# EAGLE design rng.1.0 (EAGLE 6.3)
Assembly variants: 3cpu, proto
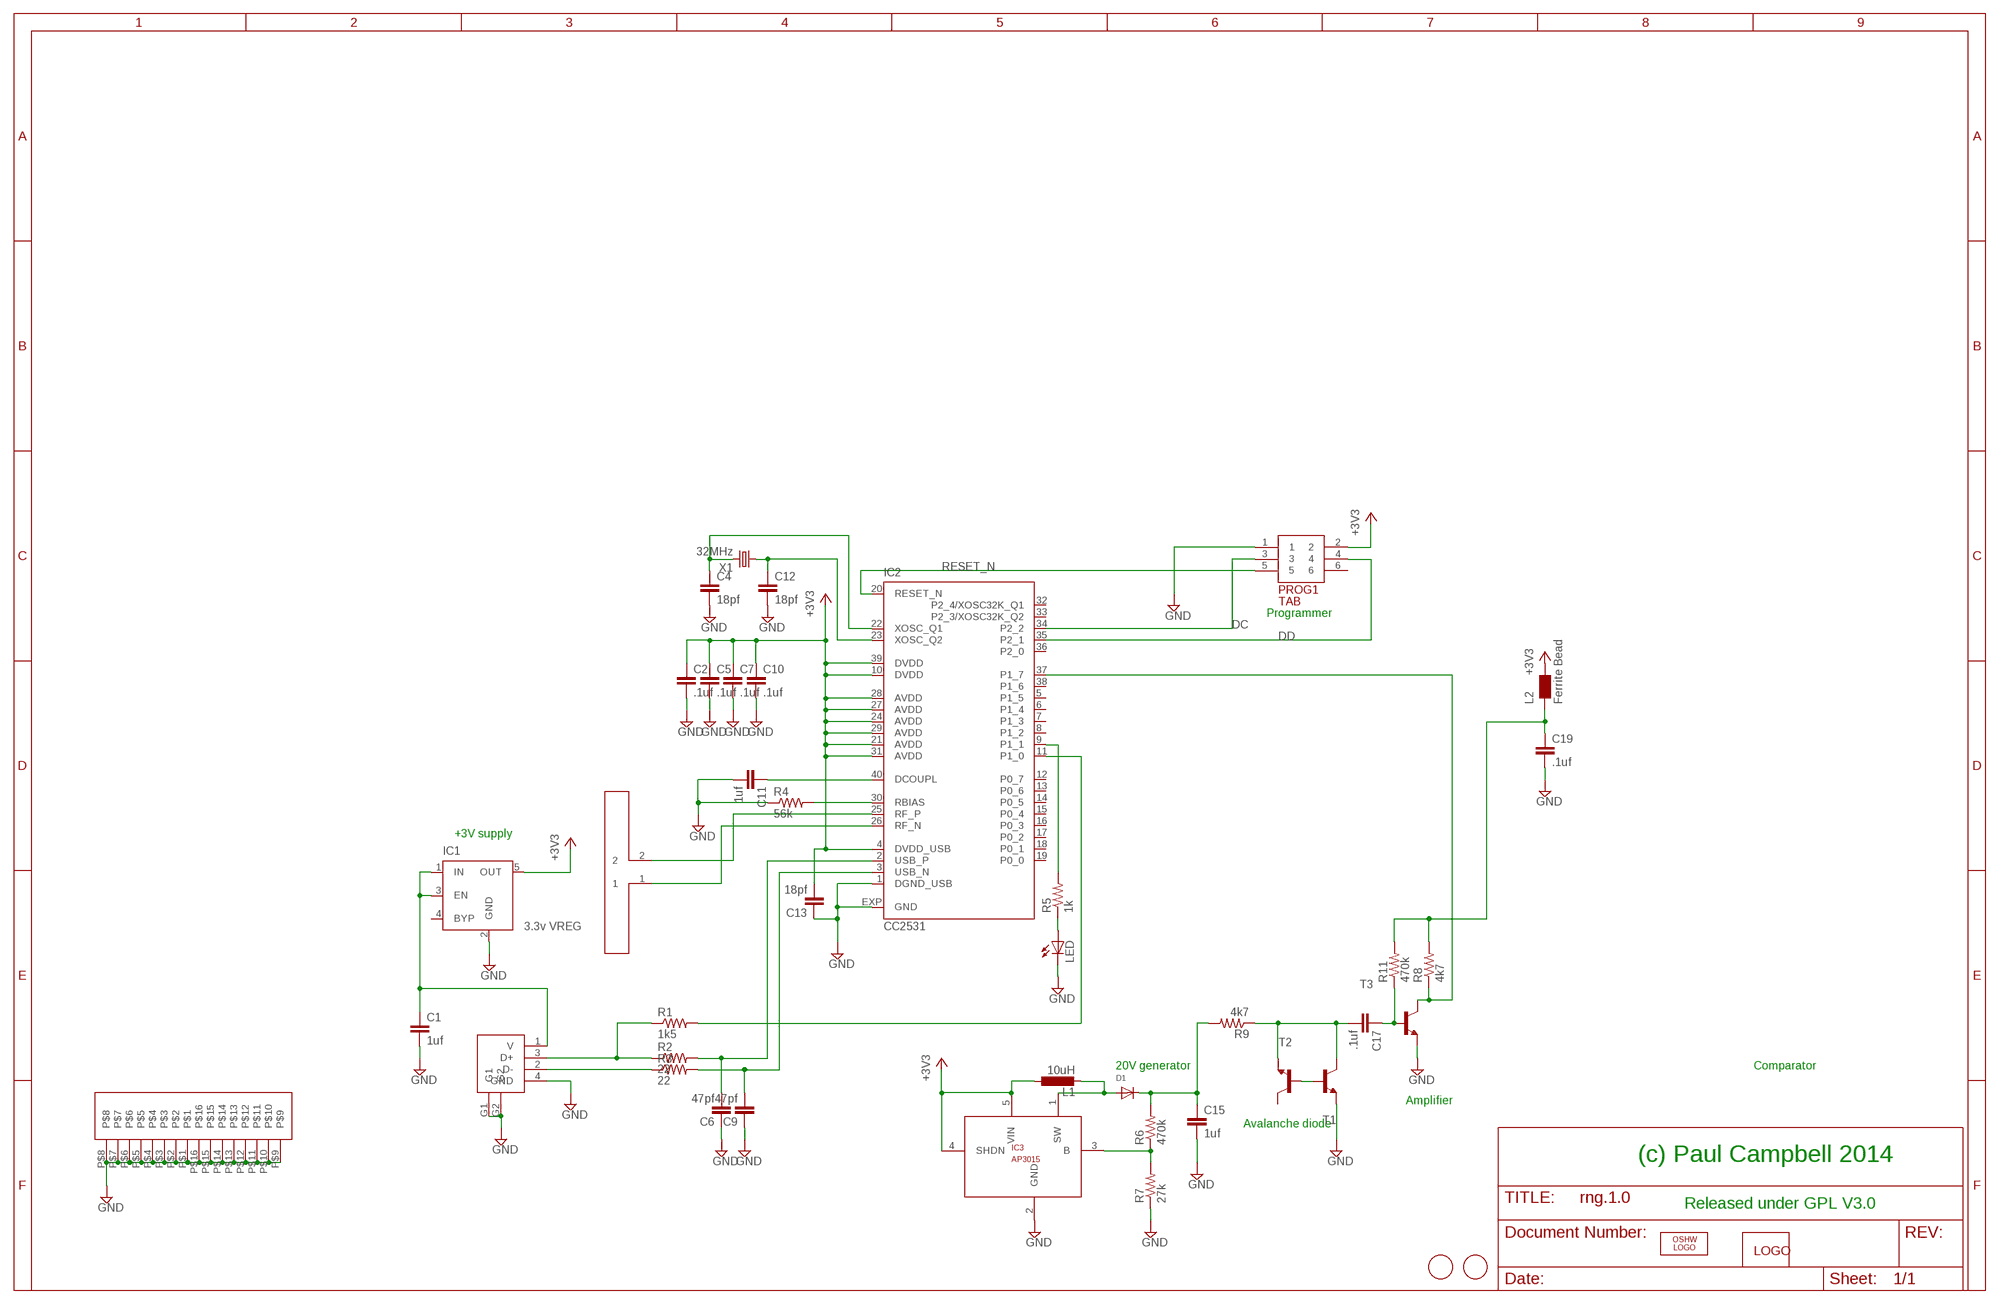
[diagram p0: schematic, sheet 1]

## Parts
C1  1uf  C-EUC0603  [C0603]
C2  .1uf  C-EUC0603  [C0603]
C4  18pf  C-EUC0603  [C0603]
C5  .1uf  C-EUC0603K  [C0603K]
C6  47pf  C-EUC0603  [C0603]
C7  .1uf  C-EUC0603  [C0603]
C9  47pf  C-EUC0603  [C0603]
C10  .1uf  C-EUC0603  [C0603]
C11  1uf  C-EUC0603  [C0603]
C12  18pf  C-EUC0603  [C0603]
C13  18pf  C-EUC0603  [C0603]
C15  1uf  C-EUC0603  [C0603]
C17  .1uf  C-EUC0603  [C0603]
C19  .1uf  C-EUC0603  [C0603]
D1  DIODESOD-323F  [SOD-323F]
IC1  3.3v VREG  MIC5219XX  [SOT23-5]
IC2  CC2531  [RHA_S-PVQFN-N40]
IC3  AP3015  [SOT23-5]
L1  10uH  L-EUL2012C  [L2012C]
L2  Ferrite Bead  WE-CBF_0805  [0805]
LED  LEDCHIP-LED0603  [CHIP-LED0603]
LOGO1  OSHW_LOGO_FILLX0100-NT  [OSHW_FILLX100_NOTEXT]
PROG1  TAB  [TAG]
R1  1k5  R-US_R0603  [R0603]
R2  22  R-US_R0603  [R0603]
R3  22  R-US_R0603  [R0603]
R4  56k  R-US_R0603  [R0603]
R5  1k  R-US_R0603  [R0603]
R6  470k  R-US_R0603  [R0603]
R7  27k  R-US_R0603  [R0603]
R8  4k7  R-US_R0603  [R0603]
R9  4k7  R-US_R0603  [R0603]
R11  470k  R-US_R0603  [R0603]
T1  BCF32-NPN-SOT23-BEC  [SOT23-BEC]
T2  BCF32-NPN-SOT23-BEC  [SOT23-BEC]
T3  BCF32-NPN-SOT23-BEC  [SOT23-BEC]
U$1  USB-RAW  [USBY]
U$2  DIPOLEDIPOLE1  [DIPOLE]
U$3  FIDUCIAL  [FIDUCIAL_1MM]
U$4  FIDUCIAL  [FIDUCIAL_1MM]
U$5  MOONBASE-LOGO  [MOONBASE-LOGO]
U$6  BMI-S-2-09  [SHIELD-209]
X1  32MHz  CRYSTALSM49  [SM49]

## Nets
+3V3: C2.1 C5.1 C7.1 C10.1 C13.2 IC1.5(OUT) IC2.4(DVDD_USB) IC2.10(DVDD) IC2.21(AVDD) IC2.24(AVDD) IC2.27(AVDD) IC2.28(AVDD) IC2.29(AVDD) IC2.31(AVDD) IC2.39(DVDD) IC3.4(SHDN) IC3.5(VIN) L1.1 L2.2 PROG1.2
DC: IC2.34(P2_2) PROG1.3
DD: IC2.35(P2_1) PROG1.4
GND: C1.2 C2.2 C4.2 C5.2 C6.1 C7.2 C9.1 C10.2 C11.2 C12.2 C13.1 C15.2 C19.2 IC1.2(GND) IC2.1(DGND_USB) IC2.EXP(GND) IC3.2(GND) LED.C PROG1.1 R4.1 R7.1 T2.E T3.E U$1.4(GND) U$1.G1 U$1.G2 U$6.P$1 U$6.P$2 U$6.P$3 U$6.P$4 U$6.P$5 U$6.P$6 U$6.P$7 U$6.P$8 U$6.P$9 U$6.P$10 U$6.P$11 U$6.P$12 U$6.P$13 U$6.P$14 U$6.P$15 U$6.P$16
N$1: T1.B T2.B
N$2: C1.1 IC1.1(IN) IC1.3(EN) U$1.1(V)
N$3: C6.2 IC2.2(USB_P) R2.2
N$4: R3.1 U$1.2(D-)
N$5: C9.2 IC2.3(USB_N) R3.2
N$6: LED.A R5.1
N$7: R1.1 R2.1 U$1.3(D+)
N$8: IC2.11(P1_0) R1.2
N$9: IC2.9(P1_1) R5.2
N$10: C11.1 IC2.40(DCOUPL)
N$11: IC2.37(P1_7) R8.1 T3.C
N$13: C17.2 R9.1 T1.E T2.C
N$15: C17.1 R11.1 T3.B
N$16: C15.1 D1.C R6.2 R9.2
N$18: C4.1 IC2.22(XOSC_Q1) X1.2
N$19: C12.1 IC2.23(XOSC_Q2) X1.1
N$20: C19.1 L2.1 R8.2 R11.2
N$22: IC2.30(RBIAS) R4.2
N$24: IC2.25(RF_P) U$2.2
N$25: IC2.26(RF_N) U$2.1
N$27: D1.A IC3.1(SW) L1.2
R88: IC3.3(B) R6.1 R7.2
RESET_N: IC2.20(RESET_N) PROG1.5
Unconnected: IC1.4(BYP) IC2.5(P1_5) IC2.6(P1_4) IC2.7(P1_3) IC2.8(P1_2) IC2.12(P0_7) IC2.13(P0_6) IC2.14(P0_5) IC2.15(P0_4) IC2.16(P0_3) IC2.17(P0_2) IC2.18(P0_1) IC2.19(P0_0) IC2.32(P2_4/XOSC32K_Q1) IC2.33(P2_3/XOSC32K_Q2) IC2.36(P2_0) IC2.38(P1_6) PROG1.6 T1.C

## Notes on the sheet
- Programmer
- +3V supply
- 20V generator | Comparator
- Amplifier
- Avalanche diode
- (c) Paul Campbell 2014
- Released under GPL V3.0

## Library data of the parts
C1 C2 C4-C7 C9-C13 C15 C17 C19 = rcl:C-EU: CAPACITOR, European symbol
D1 = adafruit:DIODE: Diode SMADIODE - SMA Surface Mount Package 20V 1A Schottky Diode Digikey: 641-1014-6-ND DO-1N4148 - Through Hole Small Current Diode SOD-123 20V 1 A (.5mV Vf) Schottky Diode - Digikey: MBRX120TPMSCT-ND SOD-323 10V 570mA (.38mV Vf, 3ns) Schottky Diode - Digikey: ZLLS410CT-ND SOD-523 30V 30mA Schottky Diode (RB751S-40TE61) - Digikey: RB751S-40TE61CT-ND SOT23-R/W - SOT23 Package (R = Solder Paste/Reflow Ovens, W = Hand-Soldering) BAT54Film 40V 300mA - Digikey: 497-7162-1-ND
IC1 = v-reg-micrel:MIC5219XX: VOLTAGE REGULATOR
IC2 = texas:CC2531: A USB Enabled System-On-Chip Solution for 2.4-GHz IEEE 802.15.4 and ZigBee Source: http://focus.ti.com/lit/ds/symlink/cc2531.pdf; MPN: CC2531F256RHAT; OC_FARNELL: 1776351; OC_NEWARK: 34R2713
IC3 = playa:AP3015
L1 = rcl:L-EU: INDUCTOR, European symbol
L2 = wuerth-elektronik:WE-CBF: SMD EMI Suppression Ferrite Beads - excellent anti-EMI properties - low DCR - impedances till 3000 ohms - rated current up to 6 A
LED = adafruit:LED: LED OSRAM: - CHIPLED LG R971, LG N971, LY N971, LG Q971, LY Q971, LO R971, LY R971 LH N974, LH R974 LS Q976, LO Q976, LY Q976 LO Q996 - Hyper CHIPLED LW Q18S LB Q993, LB Q99A, LB R99A - SideLED LS A670, LO A670, LY A670, LG A670, LP A670 LB A673, LV A673, LT A673, LW A673 LH A674 LY A675 LS A676, LA A676, LO A676, LY A676, LW A676 LS A679, LY A679, LG A679 - Hyper Micro SIDELED® LS Y876, LA Y876, LO Y876, LY Y876 LT Y87S - SmartLED LW L88C, LW L88S LB L89C, LB L89S, LG L890 LS L89K, LO L89K, LY L89K LS L896, LA L896, LO L896, LY L896 - TOPLED LS T670, LO T670, LY T670, LG T670, LP T670 LSG T670, LSP T670, LSY T670, LOP T670, LYG T670 LG T671, LOG T671, LSG T671 LB T673, LV T673, LT T673, LW T673 LH T674 LS T676, LA T676, LO T676, LY T676, LB T676, LH T676, LSB T676, LW T676 LB T67C, LV T67C, LT T67C, LS T67K, LO T67K, LY T67K, LW E67C LS E67B, LA E67B, LO E67B, LY E67B, LB E67C, LV E67C, LT E67C LW T67C LS T679, LY T679, LG T679 LS T770, LO T770, LY T770, LG T770, LP T770 LB T773, LV T773, LT T773, LW T773 LH T774 LS E675, LA E675, LY E675, LS T675 LS T776, LA T776, LO T776, LY T776, LB T776 LHGB T686 LT T68C, LB T68C - Hyper Mini TOPLED® LB M676 - Mini TOPLED Santana® LG M470 LS M47K, LO M47K, LY M47K Source: http://www.osram.convergy.de/
LOGO1 = ohw-logo:OSHW_LOGO_FILL
PROG1 = br:TAB
R1-R9 R11 = rcl:R-US_: RESISTOR, American symbol
T1-T3 = transistor-neu-to92:*-NPN-: NPN Transistror
U$1 = playa:USB-RAW
U$2 = playa:DIPOLE
U$3 U$4 = adafruit:FIDUCIAL: For use by pick and place machines to calibrate the vision/machine, 1mm By microbuilder.eu
U$5 = ll:MOONBASE-LOGO
U$6 = playa:BMI-S-2-09
X1 = crystal:CRYSTAL: CRYSTAL

## Board
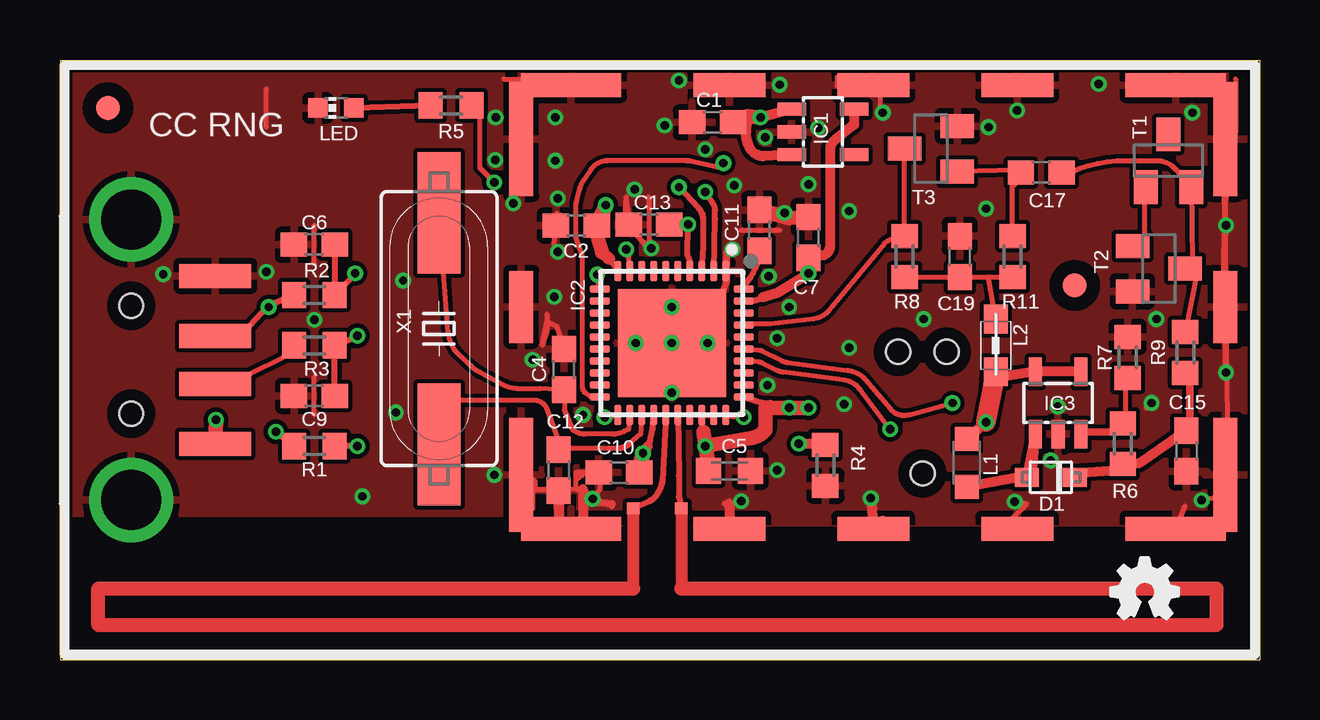
[diagram p1: board, top side]
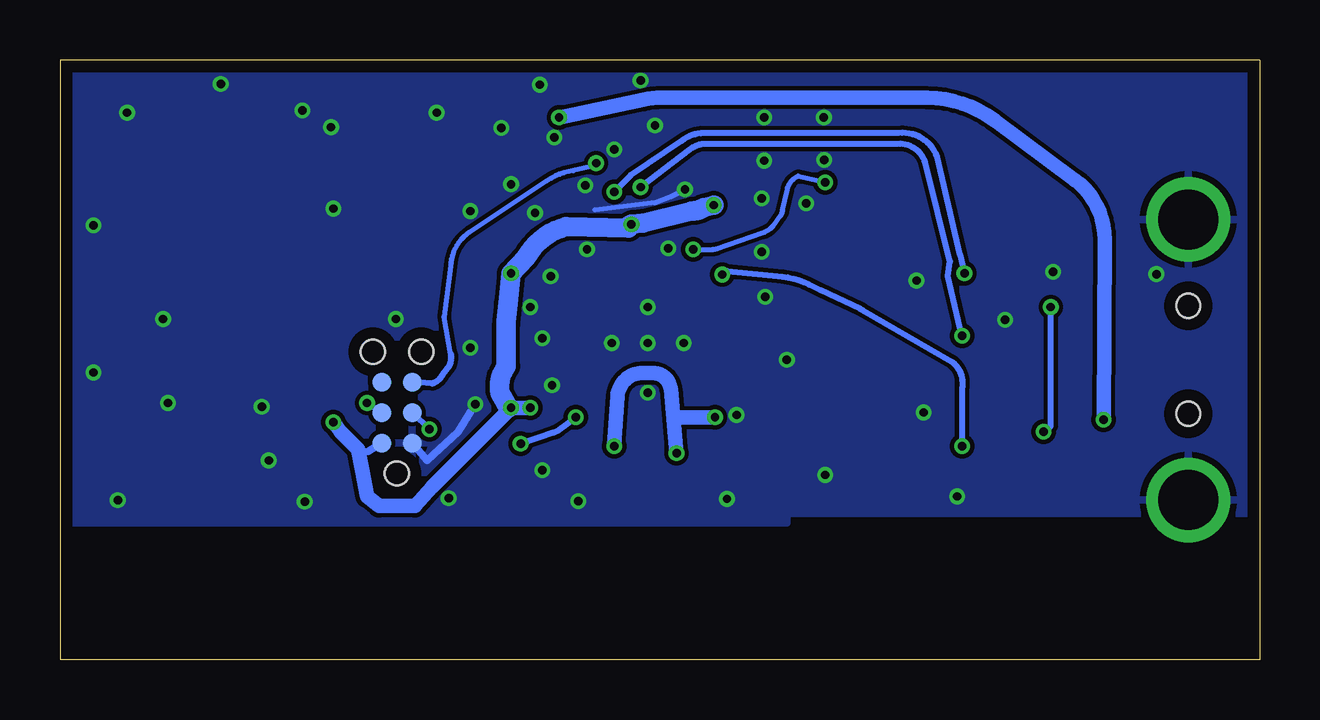
[diagram p2: board, bottom side, seen from below]

Size 50 x 25 mm. Coordinates in mm from the lower left corner, seen from the top.
Outline: 0,0 50,0 50,25 0,25 0,0
Copper layers (1*16): Top 0.035mm / dielectric 1.5mm / Bottom 0.035mm
Design rules "EagleRules": minimum track width 7mil, minimum drill 12mil, track to track 7mil, track to pad 7mil, pad to pad 7mil, via to via 7mil, smd to smd 0mil, copper to edge 20mil, drill to drill 10mil, minimum pad ring 10mil, minimum via ring 6mil, stop-mask expansion 2mil, vias tented up to drill 25mil, thermal gap 10mil

### Footprints (pad centres in the part's own frame; a part is rotated, then mirrored left to right if it is on the bottom)
C0603 = smd 1.1 x 1: 1 -0.85,0; 2 0.85,0
C0603K = smd 1.05 x 1.08: 1 -0.875,0; 2 0.875,0
SOD-323F = smd 1 x 0.8: A -1,0; C 1,0
SOT23-5 = smd 0.55 x 1.2: 1 -0.95,-1.3; 2 0,-1.3; 3 0.95,-1.3; 4 0.95,1.3; 5 -0.95,1.3
RHA_S-PVQFN-N40 = smd 0.85 x 0.3: 1 -3,2.25; 2 -3,1.75; 3 -3,1.25; 4 -3,0.75; 5 -3,0.25; 6 -3,-0.25; 7 -3,-0.75; 8 -3,-1.25; 9 -3,-1.75; 10 -3,-2.25; 21 3,-2.25; 22 3,-1.75; 23 3,-1.25; 24 3,-0.75; 25 3,-0.25; 26 3,0.25; 27 3,0.75; 28 3,1.25; 29 3,1.75; 30 3,2.25 | smd 0.3 x 0.85: 11 -2.25,-3; 12 -1.75,-3; 13 -1.25,-3; 14 -0.75,-3; 15 -0.25,-3; 16 0.25,-3; 17 0.75,-3; 18 1.25,-3; 19 1.75,-3; 20 2.25,-3; 31 2.25,3; 32 1.75,3; 33 1.25,3; 34 0.75,3; 35 0.25,3; 36 -0.25,3; 37 -0.75,3; 38 -1.25,3; 39 -1.75,3; 40 -2.25,3 | smd 4.5 x 4.5: EXP 0,0
L2012C = smd 1 x 1: 1 -1,0; 2 1,0
0805 = smd 1.2 x 1: 1 -1.1,0; 2 1.1,0
CHIP-LED0603 = smd 0.8 x 0.8: A 0,-0.75; C 0,0.75
TAG = smd 0.787 x 0.787 bottom: 1 -1.27,0.635; 2 -1.27,-0.635; 3 0,0.635; 4 0,-0.635; 5 1.27,0.635; 6 1.27,-0.635 | hole 1: -2.54,0; 2.54,1.016; 2.54,-1.016
R0603 = smd 1 x 1.1: 1 -0.85,0; 2 0.85,0
SOT23-BEC = smd 1 x 1.4: B -0.95,-1.1; C 0,1.1; E 0.95,-1.1
USBY = smd 1 x 3: 1 3.5,3.5; 2 1,3.5; 3 -1,3.5; 4 -3.5,3.5 | drill 2.5: G1 5.85,0; G2 -5.85,0 | hole 1: -2.25,0; 2.25,0
DIPOLE = smd 0.51 x 0.51: 1 -1,0; 2 1,0
FIDUCIAL_1MM = smd 1 x 1: 1 0,0
SHIELD-209 = smd 1 x 3: P$1 -14.68,0; P$2 14.68,0 | smd 4.18 x 1: P$3 -12.6,-9.25; P$8 12.6,-9.25; P$9 12.6,9.25; P$10 -12.6,9.25 | smd 1 x 4.75: P$4 -14.68,-7; P$5 -14.68,7; P$6 14.68,7; P$7 14.68,-7 | smd 3 x 1: P$11 -6,-9.25; P$12 0,-9.25; P$13 6,-9.25; P$14 -6,9.25; P$15 0,9.25; P$16 6,9.25
SM49 = smd 5.08 x 1.778: 1 -4.826,0; 2 4.826,0

### Placement (x,y rotation side)
C1  27.2,22.4 180 top
C2  21.52,18.1 180 top
C4  21,12.1 90 top
C5  27.9,7.87 0 top
C6  10.6,17.3 0 top
C7  31.2,17.6 90 top
C9  10.6,11 0 top
C10  23.3,7.8 180 top
C11  29.15,17.9 90 top
C12  20.78,7.9 270 top
C13  24.55,18.13 0 top
C15  46.95,8.7 270 top
C17  40.9,20.3 0 top
C19  37.5,16.8 90 top
D1  41.3,7.6 0 top
IC1  31.8,22 270 top
IC2  25.5,13.2 270 top
IC3  41.6,10.7 0 top
L1  37.8,8.2 270 top
L2  39,13.1 270 top
LED  11.5,23 90 top
LOGO1  43.8,1.7 0 top
PROG1  35.95,10.3 90 top
R1  10.6,8.9 0 top
R2  10.6,15.2 0 top
R3  10.6,13.1 0 top
R4  31.9,8.1 90 top
R5  16.3,23.1 0 top
R6  44.3,9 270 top
R7  44.5,12.6 270 top
R8  35.2,16.8 270 top
R9  46.9,12.8 270 top
R11  39.7,16.8 270 top
T1  46.2,20.8 0 top
T2  45.8,16.3 270 top
T3  36.3,21.3 90 top
U$1  2.97,12.5 270 top
U$2  24.9,6.3 180 top
U$3  42.3,15.6 0 top
U$4  2,23 0 top
U$5  5,0.4 0 top
U$6  33.9,14.7 0 top
X1  15.8,13.8 90 top

### Tracks (layer width: path | path; a pad name or v marks a point on that pad's centre or on a via)
+3V3  (via drill 0.35)
  Top 0.2: v38.6,9.9 38.6,9.7
  Top 0.254: 26.7,10.2 IC2.28 IC2.29 | 26.7,10.2 IC2.27 | 26.83,9.5 26.8,9.7 26.7,10.2 | 27,8.3 C5.1 | 22.9,16.7 IC2.10 | IC2.39 28.77,14.95 arc29 29.29,15.11 | 24.5,8.9 24.6,9.1 24.7,9.6 IC2.24 | IC2.21 v22.7,10.1 | IC2.31 29.3,10.7 29.6,10.7 v31.2,10.5 | v31.2,16.1 31.3,17.1 C7.1 | IC2.4 26.25,16.55 arc34 26.17,16.83 v26.18,18.15
  Top 0.406: 29.29,15.11 29.9,15.3 v31.2,16.1 | 24.5,8.9 v24.3,8.6 | C13.2 v26.18,18.15 | IC3.4 IC3.5 38.7,11.7 v38.6,9.9 L1.1 | IC1.5 33.1,22.3 32.33,21.68 arc51 32.1,21.31 32.1,17.24 arc-81 31.77,16.84 C7.1
  Top 0.5: 22.6,17 22.9,16.7
  Top 0.61: v26.9,8.9 27,8.2 27,8.3 v26.9,8.9 | v31.2,10.5 29.4,10.5 29.4,9.6 arc-46 28.84,9.24 v26.9,8.9 | v26.9,8.9 26.87,8.92 | 22.6,17 22.3,18 v22.75,18.95 22.5,18.3 C2.1 | C10.1 24.1,7.8 v24.3,8.6 | 26.83,9.5 v26.9,8.9 | C7.1 v31.2,16.1
  Top 0.813: L2.2 v38.6,9.9
  Bottom 0.2: 37.15,8.67 37.58,8.76
  Bottom 0.254: 24.2,10.1 24.36,9.29
  Bottom 0.305: PROG1.2 37.15,8.67
  Bottom 0.406: 24.2,8.7 v24.3,8.6
  Bottom 0.61: v24.3,8.6 24.36,9.29 24.54,11.26 arc-85 25.29,11.95 25.71,11.95 arc-86 26.77,10.96 v26.9,8.9 | 24.2,10.1 v22.7,10.1 | v31.2,10.5 v30.4,10.5 31.3,10.5 | 31.4,14.04 31.4,14.1 | 31.66,11.11 v31.2,10.5 | v31.2,10.5 34.5,7.2 35.2,6.4 36.7,6.4 37.2,6.8 37.4,7.9 37.58,8.76 38.3,9.5 v38.6,9.9
  Bottom 0.813: 31.3,10.5 31.66,11.11 arc47 31.4,12.22 31.4,13.97 arc-11 31.4,14.04 | 31.4,14.1 31.32,14.85 v31.2,16.1 30.59,16.75 arc46 28.9,18.05 26.3,18 v26.18,18.15 | v22.75,18.95 23.16,18.84 arc31 23.68,18.7 25.7,18.2 v26.18,18.15 | 26.25,18.11 v26.18,18.15
DC  (via drill 0.35)
  Top 0.2: IC2.34 29.14,12.4 arc-22 29.26,12.37 29.89,12.05 arc19 30.12,11.98 32.65,11.66 arc-46 33.37,11.24 v34.6,9.6
  Top 0.254: IC2.34 28.85,12.45 | v34.6,9.6 34.57,9.62
  Bottom 0.254: PROG1.3 v34.6,9.6
DD  (via drill 0.35)
  Top 0.2: IC2.35 29.13,12.9 arc-22 29.26,12.87 30.07,12.47 arc19 30.35,12.38 32.84,12.06 arc-42 33.6,11.64 34.62,10.45 arc65 35.38,10.21 v37.2,10.7
  Bottom 0.254: v37.2,10.7 PROG1.4
GND  (via drill 0.35)
  Top 0.2: C10.2 21.5,7.8 21.5,7.5 | 22.1,7.8 22.5,7.8 22.5,7.1 v22.2,6.7 23,6.5 | 24.55,19.3 24.55,17.1 23.8,18 23.6,19.3 23.5,18.2 24.55,17.2 | v20.75,17 20.6,17.3 20.7,18.6 | 20.7,18.6 21.1,18.5 | C2.2 20.7,18.6 | 21.5,7.1 21.8,7.1 | 21.8,5.8 U$6.P$3 | 27.9,5.6 U$6.P$11 | U$6.P$13 39.6,5.8 40.3,6.5 v39.8,6.58 | U$6.P$8 46.9,6.4 | U$6.P$6 48.5,19.8 U$6.P$2 | U$6.P$7 48.7,6.7 | 48.5,6.8 v47.59,6.64 | 48.6,17.8 v48.6,18.1 48.6,19.2 | 48.6,17.8 48.52,16.8 48.42,14.1 48.5,13.8 48.56,13.5 | 48.56,13.5 48.56,12.1 | 48.56,13.5 48.5,13.9 48.5,15 | 48.5,15 48.5,16.9 48.6,19.2 | 48.6,14.8 48.7,6.7 | 48.7,6.7 48.5,6.8 | 48.5,6.2 48.5,6.8 | 48.5,15 48.6,14.8 | 48.6,14.8 48.6,17.8 | 49,24.2 49,22 | 48.6,19.2 49,22 | 47,23.6 48.9,23.6 48.9,22 49,22 | 28.4,17.9 30,17.9 | 21.5,7.1 21.5,7.5 | 20.3,14.4 20.3,13.7 20.1,13.1 20.3,14.1 20.7,13.9 C4.2 | 21.5,7.5 21.8,7.7 | 10.6,10.2 10.6,11.8 | 10.6,16.5 10.6,18.1 | 8.6,22.2 8.6,23.8 | 21.5,7.1 20.5,7.1 19.7,7.1 19.7,6.3 19.4,6.1 19,6.1 | v34.3,22.8 34.2,22.8 34.2,23.7 34.4,24.2 32.4,24.2 | 32.4,23.9 32.4,24.2 | 32.4,24.2 32.4,24.3 34.3,24.3 U$6.P$15 34.3,23.9 | 18.5,24.2 20.4,24.2 20.4,24.3 U$6.P$10
  Top 0.254: 23,6.4 23,6.5 | v28.4,6.6 27.9,6.5 27.7,6.5 | 27.8,16.4 IC2.1 27.8,16.1 27.8,15.8 27.5,15.1 | 45.3,10.5 v45.5,10.7
  Top 0.305: 23,6.5 22,6.6 v22.2,6.7 | v28.03,17.1 27.8,17 IC2.1
  Top 0.406: 22,6.6 21.8,7.1 21.8,5.8 | 19.7,7.4 19.7,7.1 | 27.9,6.5 27.9,5.6 | v33.8,6.73 U$6.P$12 34.3,5.8 | 20.5,7.1 20.8,7.1 20.8,5.5 C12.2
  Top 0.61: C11.2 30.4,18.4 C7.2
  Bottom 0.2: 27.7,18.75 25.2,19.05 24.55,19.3 v23.95,19.6
  Bottom 0.305: PROG1.1 34.7,8.3 33.4,9.5 v32.69,10.64
  other vias: 25.5,14.7 25.5,11.12 27,13.2 24,13.2 12.6,6.8 29.9,7.9 21.8,10.2 29.49,11.44 30.2,18.62 25.5,13.2 14,10.3 26.9,21.27 10.6,14.17 31.2,19.82 14.3,15.8 45.7,14.2 18.9,19.02 29.55,15.98 20.6,15.12 38.6,18.8 43.3,24 24.65,17.15 41.59,10.54 41.3,8.3 38.7,22.2 32.9,13 30.4,14.7 29.9,13.4 4.3,16.07 19.7,12.5 30,23.97 28.1,19.77 8.6,16.17 39.9,22.9 36,14.2 48.6,11.97 47.2,22.8 25.2,22.27 20.75,19.23 20.65,20.8 18.15,20.83 18.1,7.7 18.16,22.6 29.4,21.77 31.6,22.17 20.65,22.6 32.9,18.7 25.8,24.15
  pour Top: 0,25 50,25 50,5.7 19.7,5.7 19.7,6.1 0,6.1
  pour Bottom: 0,6.1 19.7,6.1 19.7,5.7 50,5.7 50,25 0,25
N$1
  Top 0.2: 45.2,19.3 45.2,17.4
  Top 0.305: T1.B 45.2,19.3 | 45.2,17.4 T2.B
N$2  (via drill 0.35)
  Top 0.406: IC1.1 v29.2,22.6 | IC1.3 29.29,20.99 arc-72 28.69,21.48 28.6,21.8 28.66,22.65
  Top 0.61: U$1.1 v6.5,10 | v29.2,22.6 28.66,22.65 C1.1
  Bottom 0.61: v6.5,10 6.45,17.51 arc-54 7.7,20 11.06,22.48 arc-36 13.84,23.42 25.12,23.42 arc-12 25.68,23.34 v29.2,22.6
N$3  (via drill 0.35)
  Top 0.254: IC2.2 27.31,18.36 27.3,18.74 arc32 27.21,19.03 v26.9,19.5 | C6.2 R2.2 v12.3,16.1
  Bottom 0.254: v26.9,19.5 26.2,20.2 24.08,21.63 arc38 23.16,21.95 15.03,21.95 arc76 13.43,20.95 12.5,16.9 v12.3,16.1
N$4
  Top 0.2: R3.1 9.3,12.6 7.9,11.9 U$1.2
N$5  (via drill 0.35)
  Top 0.254: IC2.3 26.82,17.2 26.82,18.32 arc43 26.63,18.8 v25.8,19.7 | C9.2 R3.2 v12.4,13.5
  Bottom 0.254: v25.8,19.7 23.77,21.25 arc39 23.08,21.5 15.08,21.5 arc76 13.93,20.72 12.9,16.6 13,16 v12.4,13.5
N$6
  Top 0.254: R5.1 LED.A
N$7  (via drill 0.35)
  Top 0.254: U$1.3 7.58,13.81 arc77 7.9,13.9 8.68,14.73 | R2.1 8.68,14.73 | R1.1 v9,9.5 | v8.7,14.7 8.68,14.73
  Bottom 0.254: v9,9.5 8.7,9.73 v8.7,14.7
N$8  (via drill 0.35)
  Top 0.254: IC2.11 v22.4,16.05 | v12.4,8.9 R1.2
  Bottom 0.254: v22.4,16.05 22.2,16.2 19.89,15.96 arc21 18.77,15.63 18.3,15.4 16.66,14.63 arc5 16.55,14.57 12.8,12.4 arc60 12.4,11.29 v12.4,8.9
N$9  (via drill 0.35)
  Top 0.2: IC2.9 23.7,16.8 v23.6,17.1 | v18.1,19.9 17.5,20.5 17.5,22.9 R5.2
  Bottom 0.2: v23.6,17.1 22.79,17.1 arc-19 22.61,17.13 20.71,17.79 arc-35 20.21,18.16 19.96,18.51 arc-23 19.88,18.71 19.69,19.6 arc54 19.22,20.17 v18.1,19.9
N$10
  Top 0.254: C11.1 arc-43 28.42,15.52 IC2.40
N$11
  Top 0.2: IC2.37 28.9,14 29.6,14 31.42,14.2 arc44 32.08,14.6 34.36,17.34 arc-43 34.71,17.52 34.93,17.54 R8.1 T3.C
N$13
  Top 0.2: T2.C 47.2,16.6 T1.E 46.52,20.43 arc49 45.71,20.8 44.45,20.8 arc26 42.1,20.3 C17.2 | 47.1,16.4 47.4,16.2 R9.1
  Top 0.305: T2.C 47.1,16.4
N$15
  Top 0.2: R11.1 39.7,20.1 39.8,20.1 | 39.8,20.1 39.8,20.4 39.9,20.4 T3.B | C17.1 39.8,19.8 39.8,20.1
N$16
  Top 0.305: R9.2 47.1,11.8 47.1,9.9 C15.1
  Top 0.406: D1.C 42.6,7.8 44.1,7.9 R6.2 45,8.2 C15.1
N$18
  Top 0.2: IC2.22 23.7,9.6 23.52,9.51 arc-27 23.06,9.4 21.88,9.4 arc-39 21.38,9.57 21.02,10.42 C4.1 20,11.3 19.14,11.3 arc-24 18.49,11.44 17.52,11.97 arc-25 17.04,12.33 16.48,12.87 arc-14 16.45,12.91 16.31,13.18 arc-23 16.18,13.64 X1.2
N$19
  Top 0.2: IC2.23 24.2,9.4 23.7,8.97 | 23.24,8.8 20.9,8.8 20.32,10.42 arc57 19.88,10.8 16.3,10.8
  Top 0.254: 23.7,8.97 arc-41 23.24,8.8 | C12.1 20.9,8.8 | 16.3,10.8 16.4,10.2 X1.1
N$20
  Top 0.2: L2.1 38.7,15.95 R11.2 C19.1 R8.2
N$22  (via drill 0.35)
  Top 0.254: IC2.30 v28.5,10.1 | 31.9,9 32,8.9 R4.2
  Top 0.406: 31.9,9 v30.8,9
  Bottom 0.254: v28.5,10.1 29.21,9.57 arc18 29.41,9.46 v30.8,9
N$24
  Top 0.254: IC2.25 25.11,7.47 arc-24 24.93,6.95 arc-39 24.55,6.59 U$2.2
N$25
  Top 0.254: IC2.26 25.8,7.66 25.8,6.8 U$2.1 25.8,6.4
N$27
  Top 0.406: 40,7.5 40.5,7.7 | 40.5,7.7 IC3.1 D1.A | 40.5,7.7 L1.2
R88
  Top 0.2: R7.2 44.4,11.6 44.4,10 R6.1
  Top 0.305: IC3.3 42.5,9.5 44.1,9.5 R6.1
RESET_N  (via drill 0.35)
  Top 0.2: IC2.20 22.07,10.99 21.91,11.11 arc-52 21.78,11.35 21.78,16.8 21.5,17.6 21.5,18.81 arc-13 21.53,19.09 21.65,19.6 arc-21 21.82,19.97 22.13,20.43 arc-56 22.83,20.8 26.08,20.8 arc-13 26.33,20.77 27.39,20.52 v27.65,20.7
  Bottom 0.2: 33.72,12.75 34,14.3 33.71,16.56 arc49 32.93,17.81 29.7,19.97 arc26 28.61,20.38 27.7,20.6 v27.65,20.7
  Bottom 0.254: 33.72,12.75 arc33 33.77,12.27 34.07,11.86 arc45 34.48,11.51 PROG1.5

### Text on the board
tNames: CC RNG
tDocu: V1.0 | (C) Paul Campbell 2014
_tPlace: IC3
_tNames: C1 | IC1 | LED | R5 | T1 | T3 | C13 | C17 | C6 | C2 | C11 | R2 | T2 | IC2 | C7 | R8 | C19 | R11 | X1 | L2 | R7 | R3 | C4 | R9 | C9 | C12 | C15 | C10 | C5 | L1 | R1 | R4 | R6 | D1